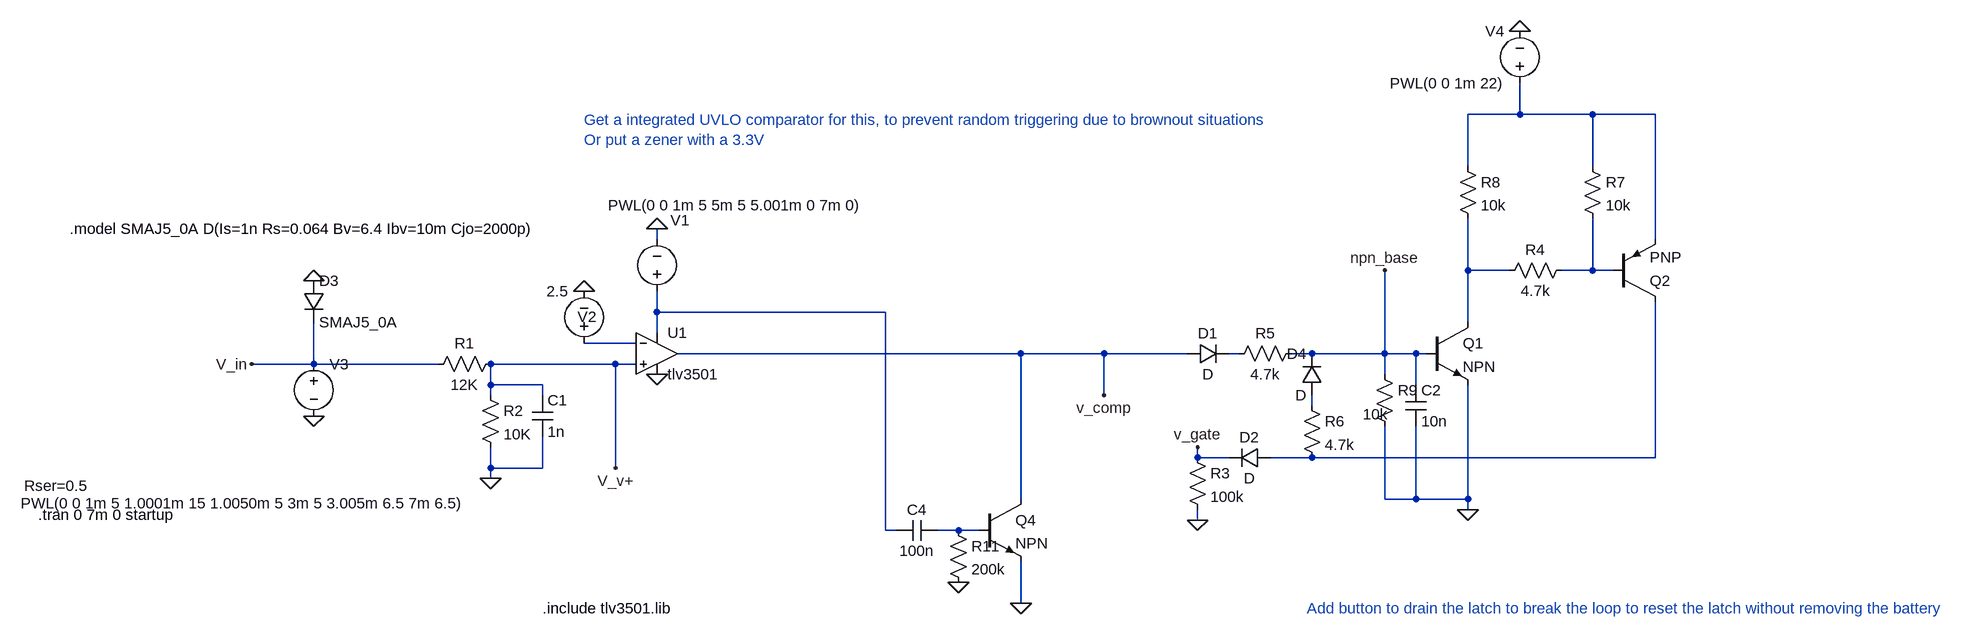
[diagram p0: schematic OVP_test.asc]
OVP_test.asc, the LTspice schematic file:
Version 4.1
SHEET 1 1380 916
WIRE 608 -208 608 -256
WIRE 608 -208 528 -208
WIRE 720 -208 608 -208
WIRE 816 -208 720 -208
WIRE 528 -128 528 -208
WIRE 720 -128 720 -208
WIRE -720 -16 -720 -32
WIRE 816 -16 816 -208
WIRE 528 32 528 -48
WIRE 592 32 528 32
WIRE 720 32 720 -48
WIRE 720 32 672 32
WIRE 752 32 720 32
WIRE -720 96 -720 64
WIRE -368 96 -720 96
WIRE 528 112 528 32
WIRE -720 128 -720 96
WIRE -752 144 -832 144
WIRE -160 160 -688 160
WIRE -32 160 -160 160
WIRE 96 160 -32 160
WIRE 176 160 160 160
WIRE 288 160 256 160
WIRE 400 160 400 32
WIRE 400 160 288 160
WIRE 448 160 400 160
WIRE 464 160 448 160
WIRE -1248 176 -1248 112
WIRE -1248 176 -1344 176
WIRE -1056 176 -1248 176
WIRE -784 176 -976 176
WIRE -752 176 -784 176
WIRE 400 192 400 160
WIRE -976 208 -976 176
WIRE -896 208 -976 208
WIRE 448 208 448 160
WIRE -976 224 -976 208
WIRE -896 224 -896 208
WIRE -32 224 -32 160
WIRE 288 240 288 224
WIRE 112 320 112 304
WIRE 160 320 112 320
WIRE 288 320 224 320
WIRE 816 320 816 80
WIRE 816 320 288 320
WIRE -976 336 -976 304
WIRE -896 336 -896 288
WIRE -896 336 -976 336
WIRE -784 336 -784 176
WIRE -976 352 -976 336
WIRE -160 384 -160 160
WIRE 400 384 400 272
WIRE 448 384 448 272
WIRE 448 384 400 384
WIRE 528 384 528 208
WIRE 528 384 448 384
WIRE 528 400 528 384
WIRE 112 416 112 400
WIRE -368 432 -368 96
WIRE -352 432 -368 432
WIRE -256 432 -288 432
WIRE -224 432 -256 432
WIRE -160 544 -160 480
FLAG -720 -32 0
FLAG -720 192 0
FLAG 528 400 0
FLAG -832 64 0
FLAG -1248 48 0
FLAG -1248 256 0
FLAG -1344 176 V_in
FLAG -784 336 V_v+
FLAG -32 224 v_comp
FLAG 112 304 v_gate
FLAG 608 -336 0
FLAG -976 352 0
FLAG 112 416 0
FLAG -160 544 0
FLAG -256 512 0
FLAG 400 32 npn_base
SYMBOL OpAmps\\opamp2 -720 96 R0
SYMATTR InstName U1
SYMATTR Value tlv3501
SYMBOL voltage -720 80 R180
WINDOW 0 -50 125 Left 2
WINDOW 3 -317 148 Left 2
WINDOW 123 0 0 Left 0
WINDOW 39 0 0 Left 0
SYMATTR InstName V1
SYMATTR Value PWL(0 0 1m 5 5m 5 5.001m 0 7m 0)
SYMBOL voltage -832 160 R180
WINDOW 0 -19 57 Left 2
WINDOW 123 0 0 Left 0
WINDOW 39 0 0 Left 0
SYMATTR InstName V2
SYMATTR Value 2.5
SYMBOL npn 464 112 R0
SYMATTR InstName Q1
SYMBOL pnp 752 80 M180
SYMATTR InstName Q2
SYMBOL res 688 16 R90
WINDOW 0 0 56 VBottom 2
WINDOW 3 32 56 VTop 2
SYMATTR InstName R4
SYMATTR Value 4.7k
SYMBOL res 272 144 R90
WINDOW 0 0 56 VBottom 2
WINDOW 3 32 56 VTop 2
SYMATTR InstName R5
SYMATTR Value 4.7k
SYMBOL diode 96 176 R270
WINDOW 0 32 32 VTop 2
WINDOW 3 0 32 VBottom 2
SYMATTR InstName D1
SYMBOL res 272 224 R0
SYMATTR InstName R6
SYMATTR Value 4.7k
SYMBOL diode 224 304 R90
WINDOW 0 0 32 VBottom 2
WINDOW 3 32 32 VTop 2
SYMATTR InstName D2
SYMBOL res 704 -144 R0
SYMATTR InstName R7
SYMATTR Value 10k
SYMBOL diode -1264 48 R0
SYMATTR InstName D3
SYMATTR Value SMAJ5_0A
SYMBOL voltage -1248 160 R0
WINDOW 3 -451 230 Left 2
WINDOW 39 -446 203 Left 2
SYMATTR Value PWL(0 0 1m 5 1.0001m 15 1.0050m 5 3m 5 3.005m 6.5 7m 6.5)
SYMATTR SpiceLine Rser=0.5
SYMATTR InstName V3
SYMBOL voltage 608 -240 R180
WINDOW 0 24 96 Left 2
WINDOW 3 24 16 Left 2
SYMATTR InstName V4
SYMATTR Value PWL(0 0 1m 22)
SYMBOL res -960 160 R90
WINDOW 0 0 56 VBottom 2
WINDOW 3 32 56 VTop 2
SYMATTR InstName R1
SYMATTR Value 12K
SYMBOL res -992 208 R0
SYMATTR InstName R2
SYMATTR Value 10K
SYMBOL cap -912 224 R0
SYMATTR InstName C1
SYMATTR Value 1n
SYMBOL cap 432 208 R0
SYMATTR InstName C2
SYMATTR Value 10n
SYMBOL res 96 304 R0
SYMATTR InstName R3
SYMATTR Value 100k
SYMBOL res 512 -144 R0
SYMATTR InstName R8
SYMATTR Value 10k
SYMBOL diode 304 224 R180
WINDOW 0 24 64 Left 2
WINDOW 3 24 0 Left 2
SYMATTR InstName D4
SYMBOL res 384 176 R0
WINDOW 3 -18 77 Left 2
SYMATTR Value 10k
SYMATTR InstName R9
SYMBOL npn -224 384 R0
SYMATTR InstName Q4
SYMBOL cap -288 416 R90
WINDOW 0 0 32 VBottom 2
WINDOW 3 32 32 VTop 2
SYMATTR InstName C4
SYMATTR Value 100n
SYMBOL res -272 416 R0
SYMATTR InstName R11
SYMATTR Value 200k
TEXT -1624 -32 Left 2 !.model SMAJ5_0A D(Is=1n Rs=0.064 Bv=6.4 Ibv=10m Cjo=2000p)
TEXT -1672 408 Left 2 !.tran 0 7m 0 startup
TEXT -896 552 Left 2 !.include tlv3501.lib
TEXT 280 552 Left 2 ;Add button to drain the latch to break the loop to reset the latch without removing the battery
TEXT -832 -200 Left 2 ;Get a integrated UVLO comparator for this, to prevent random triggering due to brownout situations\nOr put a zener with a 3.3V

The netlist it stands for:
* OVP_test.asc
X§U1 V_v+ N005 N004 0 v_comp tlv3501  ; pins In+ In- V+ V- OUT
V1 N004 0 PWL(0 0 1m 5 5m 5 5.001m 0 7m 0)
V2 N005 0 2.5
Q1 N002 npn_base 0 0 NPN
Q2 N008 N003 N001 0 PNP
R4 N003 N002 4.7k
R5 npn_base N006 4.7k
D1 v_comp N006 D
R6 N007 N008 4.7k
D2 N008 v_gate D
R7 N001 N003 10k
D3 0 V_in SMAJ5_0A
V3 V_in 0 PWL(0 0 1m 5 1.0001m 15 1.0050m 5 3m 5 3.005m 6.5 7m 6.5) Rser=0.5
V4 N001 0 PWL(0 0 1m 22)
R1 V_v+ V_in 12K
R2 V_v+ 0 10K
C1 V_v+ 0 1n
C2 npn_base 0 10n
R3 v_gate 0 100k
R8 N001 N002 10k
D4 N007 npn_base D
R9 npn_base 0 10k
Q4 v_comp N009 0 0 NPN
C4 N009 N004 100n
R11 N009 0 200k
.model D D
.lib standard.dio
.model NPN NPN
.model PNP PNP
.lib standard.bjt
.model SMAJ5_0A D(Is=1n Rs=0.064 Bv=6.4 Ibv=10m Cjo=2000p)
.tran 0 7m 0 startup
.include tlv3501.lib
* Add button to drain the latch to break the loop to reset the latch without removing the battery
* Get a integrated UVLO comparator for this, to prevent random triggering due to brownout situations
* Or put a zener with a 3.3V
.backanno
.end